# Altium schematic sheet STM32.SchDoc
size Tabloid; SheetNumber: 2; SheetTotal: 4
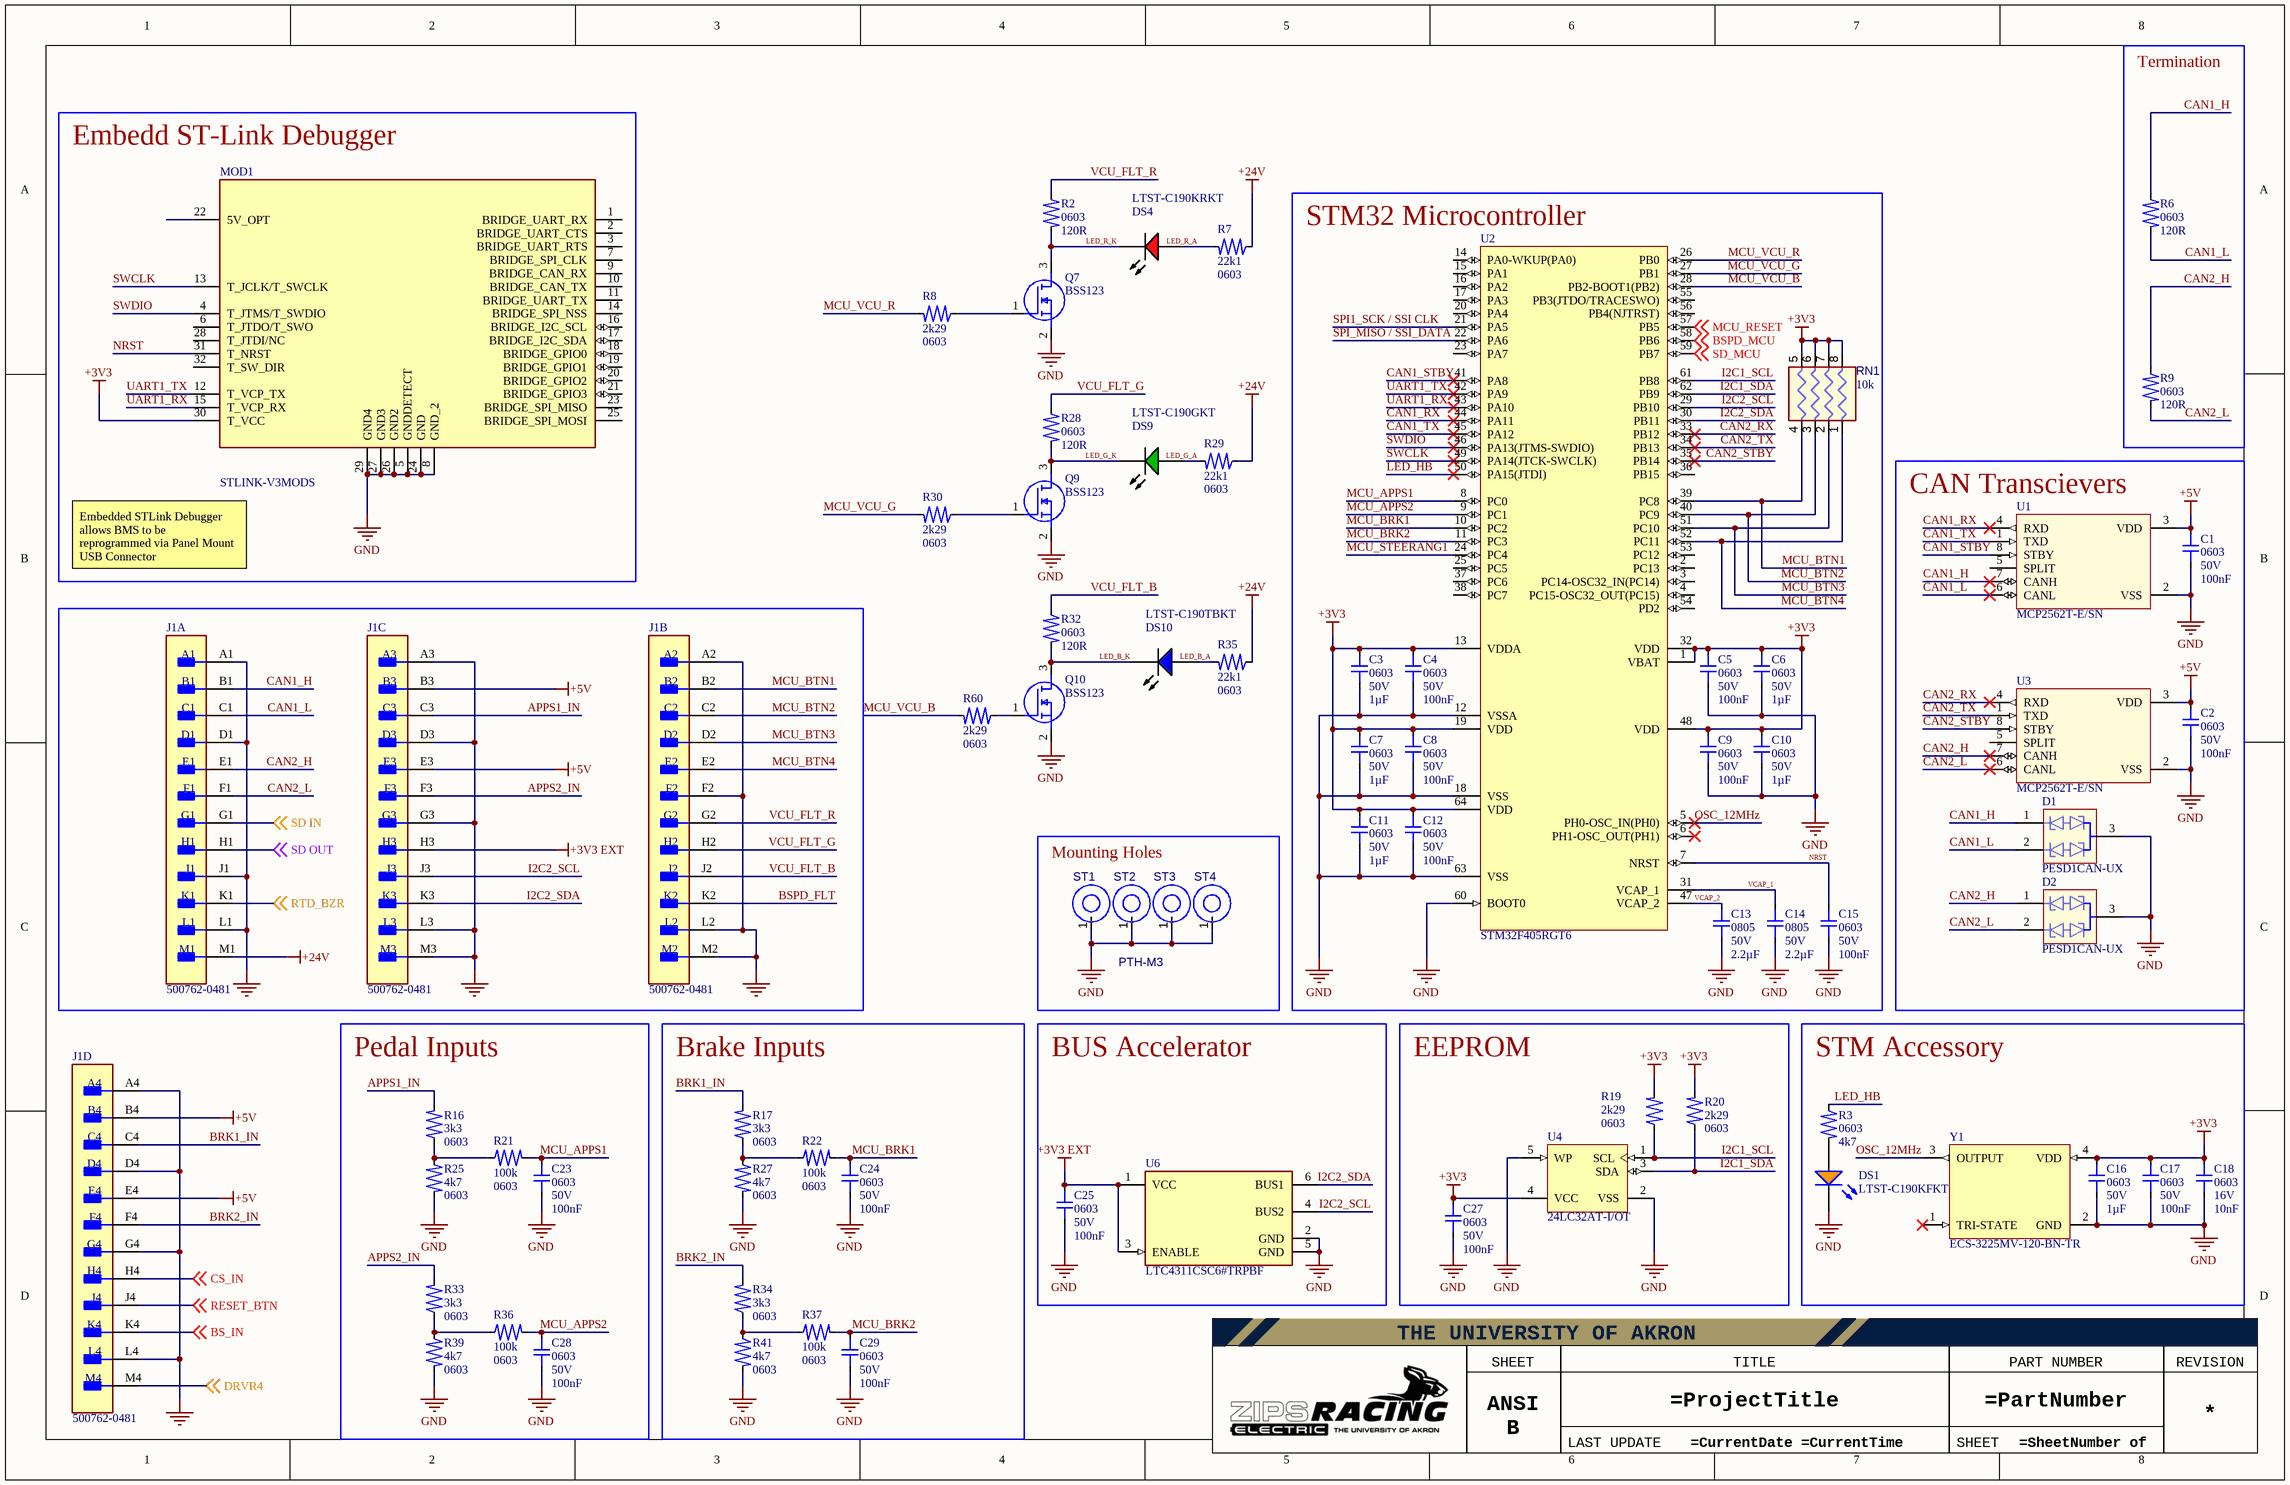
[diagram p0: STM32.SchDoc]

## Parts
C1  value 100nF  Footprint: 0603  Voltage: 50V  [CAP-0603-Generic]  (hidden comment: Capacitor 100nF 0603 5%)
C2  value 100nF  Footprint: 0603  Voltage: 50V  [CAP-0603-Generic]  (hidden comment: Capacitor 100nF 0603 5%)
C3  value 1µF  Footprint: 0603  Voltage: 50V  [CAP-0603-Generic]  (hidden comment: Capacitor 1uF 0603 5%)
C4  value 100nF  Footprint: 0603  Voltage: 50V  [CAP-0603-Generic]  (hidden comment: Capacitor 100nF 0603 5%)
C5  value 100nF  Footprint: 0603  Voltage: 50V  [CAP-0603-Generic]  (hidden comment: Capacitor 100nF 0603 5%)
C6  value 1µF  Footprint: 0603  Voltage: 50V  [CAP-0603-Generic]  (hidden comment: Capacitor 1uF 0603 5%)
C7  value 1µF  Footprint: 0603  Voltage: 50V  [CAP-0603-Generic]  (hidden comment: Capacitor 1uF 0603 5%)
C8  value 100nF  Footprint: 0603  Voltage: 50V  [CAP-0603-Generic]  (hidden comment: Capacitor 100nF 0603 5%)
C9  value 100nF  Footprint: 0603  Voltage: 50V  [CAP-0603-Generic]  (hidden comment: Capacitor 100nF 0603 5%)
C10  value 1µF  Footprint: 0603  Voltage: 50V  [CAP-0603-Generic]  (hidden comment: Capacitor 1uF 0603 5%)
C11  value 1µF  Footprint: 0603  Voltage: 50V  [CAP-0603-Generic]  (hidden comment: Capacitor 1uF 0603 5%)
C12  value 100nF  Footprint: 0603  Voltage: 50V  [CAP-0603-Generic]  (hidden comment: Capacitor 100nF 0603 5%)
C13  value 2.2µF  Footprint: 0805  Voltage: 50V  [CAP-0805]  (hidden comment: Capacitor 2.2F 0805 5%)
C14  value 2.2µF  Footprint: 0805  Voltage: 50V  [CAP-0805]  (hidden comment: Capacitor 2.2F 0805 5%)
C15  value 100nF  Footprint: 0603  Voltage: 50V  [CAP-0603-Generic]  (hidden comment: Capacitor 100nF 0603 5%)
C16  value 1µF  Footprint: 0603  Voltage: 50V  [CAP-0603-Generic]  (hidden comment: Capacitor 1uF 0603 5%)
C17  value 100nF  Footprint: 0603  Voltage: 50V  [CAP-0603-Generic]  (hidden comment: Capacitor 100nF 0603 5%)
C18  value 10nF  Footprint: 0603  Voltage: 16V  [CAP-0603-Generic]  (hidden comment: Capacitor 10nF 0603 5%)
C23  value 100nF  Footprint: 0603  Voltage: 50V  [CAP-0603-Generic]  (hidden comment: Capacitor 100nF 0603 5%)
C24  value 100nF  Footprint: 0603  Voltage: 50V  [CAP-0603-Generic]  (hidden comment: Capacitor 100nF 0603 5%)
C25  value 100nF  Footprint: 0603  Voltage: 50V  [CAP-0603-Generic]  (hidden comment: Capacitor 100nF 0603 5%)
C27  value 100nF  Footprint: 0603  Voltage: 50V  [CAP-0603-Generic]  (hidden comment: Capacitor 100nF 0603 5%)
C28  value 100nF  Footprint: 0603  Voltage: 50V  [CAP-0603-Generic]  (hidden comment: Capacitor 100nF 0603 5%)
C29  value 100nF  Footprint: 0603  Voltage: 50V  [CAP-0603-Generic]  (hidden comment: Capacitor 100nF 0603 5%)
D1  PESD1CAN-UX  [FP-SOT323-MFG]
D2  PESD1CAN-UX  [FP-SOT323-MFG]
DS1  LTST-C190KFKT  [LTST-C190KFKT_V]
DS4  LTST-C190KRKT  [LTST-C191KRKT_V]
DS9  LTST-C190GKT  [LTST-C190GKT_V]
DS10  LTST-C190TBKT  [LTST-C190TBKT-2_V]
J1  500762-0481  [FP-500762-0481-MFG]  (parts A,B,C,D of 4)
MOD1  STLINK-V3MODS  [STLINK-V3MODS-Footprint-1]
Q7  BSS123  [SOT96P237X111-3N]
Q9  BSS123  [SOT96P237X111-3N]
Q10  BSS123  [SOT96P237X111-3N]
R2  value 120R  Footprint: 0603  [RES-0603-Generic]  (hidden comment: Resistor 120R 0603 1%)
R3  value 4k7  Footprint: 0603  [RES-0603-Generic]  (hidden comment: Resistor 4k7 0603 1%)
R6  value 120R  Footprint: 0603  [RES-0603-Generic]  (hidden comment: Resistor 120R 0603 1%)
R7  value 22k1  Footprint: 0603  [RES-0603-Generic]  (hidden comment: Resistor 22k1 0603 1%)
R8  value 2k29  Footprint: 0603  [RES-0603-Generic]  (hidden comment: Resistor 2k49 0603 1%)
R9  value 120R  Footprint: 0603  [RES-0603-Generic]  (hidden comment: Resistor 120R 0603 1%)
R16  value 3k3  Footprint: 0603  [RES-0603-Generic]  (hidden comment: Resistor 3k3 0603 1%)
R17  value 3k3  Footprint: 0603  [RES-0603-Generic]  (hidden comment: Resistor 3k3 0603 1%)
R19  value 2k29  Footprint: 0603  [RES-0603-Generic]  (hidden comment: Resistor 2k49 0603 1%)
R20  value 2k29  Footprint: 0603  [RES-0603-Generic]  (hidden comment: Resistor 2k49 0603 1%)
R21  value 100k  Footprint: 0603  [RES-0603-Generic]  (hidden comment: Resistor 100k 0603 1%)
R22  value 100k  Footprint: 0603  [RES-0603-Generic]  (hidden comment: Resistor 100k 0603 1%)
R25  value 4k7  Footprint: 0603  [RES-0603-Generic]  (hidden comment: Resistor 4k7 0603 1%)
R27  value 4k7  Footprint: 0603  [RES-0603-Generic]  (hidden comment: Resistor 4k7 0603 1%)
R28  value 120R  Footprint: 0603  [RES-0603-Generic]  (hidden comment: Resistor 120R 0603 1%)
R29  value 22k1  Footprint: 0603  [RES-0603-Generic]  (hidden comment: Resistor 22k1 0603 1%)
R30  value 2k29  Footprint: 0603  [RES-0603-Generic]  (hidden comment: Resistor 2k49 0603 1%)
R32  value 120R  Footprint: 0603  [RES-0603-Generic]  (hidden comment: Resistor 120R 0603 1%)
R33  value 3k3  Footprint: 0603  [RES-0603-Generic]  (hidden comment: Resistor 3k3 0603 1%)
R34  value 3k3  Footprint: 0603  [RES-0603-Generic]  (hidden comment: Resistor 3k3 0603 1%)
R35  value 22k1  Footprint: 0603  [RES-0603-Generic]  (hidden comment: Resistor 22k1 0603 1%)
R36  value 100k  Footprint: 0603  [RES-0603-Generic]  (hidden comment: Resistor 100k 0603 1%)
R37  value 100k  Footprint: 0603  [RES-0603-Generic]  (hidden comment: Resistor 100k 0603 1%)
R39  value 4k7  Footprint: 0603  [RES-0603-Generic]  (hidden comment: Resistor 4k7 0603 1%)
R41  value 4k7  Footprint: 0603  [RES-0603-Generic]  (hidden comment: Resistor 4k7 0603 1%)
R60  value 2k29  Footprint: 0603  [RES-0603-Generic]  (hidden comment: Resistor 2k49 0603 1%)
RN1  value 10k  [BOUR-CAY16-J4_V]  (hidden comment: CAY16-103J4LF)
ST1  PTH-M3  [PTH-M2D5X5]  (no BOM)
ST2  PTH-M3  [PTH-M2D5X5]  (value not drawn)  (no BOM)
ST3  PTH-M3  [PTH-M2D5X5]  (value not drawn)  (no BOM)
ST4  PTH-M3  [PTH-M2D5X5]  (value not drawn)  (no BOM)
U1  MCP2562T-E/SN  [MCP2562T-E_SN-Footprint-1]
U2  STM32F405RGT6  [STM-LQFP64_V]
U3  MCP2562T-E/SN  [MCP2562T-E_SN-Footprint-1]
U4  24LC32AT-I/OT  [SOT-23-OT5_L]
U6  LTC4311CSC6#TRPBF  [FP-SC6-6-05-08-1638-IPC_A]
Y1  ECS-3225MV-120-BN-TR  [ECS-3225MV-120-BN-TR-Footprint-1]

## Blocks framed on the sheet
Termination: R6 R9
Embedd ST-Link Debugger: MOD1
STM32 Microcontroller: C3-C15 RN1 U2
CAN Transcievers: C1 C2 D1 D2 U1 U3
Mounting Holes: ST1-ST4
Pedal Inputs: C23 C28 R16 R21 R25 R33 R36 R39
Brake Inputs: C24 C29 R17 R22 R27 R34 R37 R41
BUS Accelerator: C25 U6
EEPROM: C27 R19 R20 U4
STM Accessory: C16-C18 DS1 R3 Y1

## Nets
+3V3: C3.2 C4.2 C5.2 C6.2 C7.2 C8.2 C9.2 C10.2 C11.2 C12.2 C16.2 C17.2 C18.2 C27.2 MOD1.30(T_VCC) R19.2 R20.2 RN1.5 RN1.6 RN1.7 RN1.8 U2.1(VBAT) U2.13(VDDA) U2.19(VDD) U2.32(VDD) U2.48(VDD) U2.64(VDD) U4.4(VCC) Y1.4(VDD)
+3V3 EXT: C25.2 J1.H3 U6.1(VCC) U6.3(ENABLE)
+5V: C1.2 C2.2 J1.B3 J1.B4 J1.E3 J1.E4 U1.3(VDD) U3.3(VDD)
+24V: J1.M1 R7.1 R29.1 R35.1
GND: C1.1 C2.1 C3.1 C4.1 C5.1 C6.1 C7.1 C8.1 C9.1 C10.1 C11.1 C12.1 C13.1 C14.1 C15.1 C16.1 C17.1 C18.1 C23.1 C24.1 C25.1 C27.1 C28.1 C29.1 D1.3(common_cathode) D2.3(common_cathode) DS1.2(K) J1.A1 J1.A2 J1.A3 J1.A4 J1.D1 J1.D3 J1.D4 J1.F2 J1.G3 J1.G4 J1.J1 J1.L1 J1.L2 J1.L3 J1.L4 J1.M2 J1.M3 MOD1.5(GNDDETECT) MOD1.8(GND_2) MOD1.24(GND) MOD1.26(GND2) MOD1.27(GND3) MOD1.29(GND4) Q7.2(S) Q9.2(S) Q10.2(S) R25.2 R27.2 R39.2 R41.2 ST1.1(H1) ST2.1(H1) ST3.1(H1) ST4.1(H1) U1.2(VSS) U2.12(VSSA) U2.18(VSS) U2.60(BOOT0) U2.63(VSS) U3.2(VSS) U4.2(VSS) U4.5(WP) U6.2(GND) U6.5(GND) Y1.2(GND)
APPS1_IN: J1.C3 R16.2
APPS2_IN: J1.F3 R33.2
BRK1_IN: J1.C4 R17.2
BRK2_IN: J1.F4 R34.2
BS_IN: J1.K4 ; off-sheet BS_IN
BSPD_FLT: J1.K2
BSPD_MCU: U2.58(PB6) ; off-sheet BSPD_MCU
CAN1_H: D1.1(cathode_1) J1.B1 R6.1 U1.7(CANH)
CAN1_L: D1.2(cathode_2) J1.C1 R6.2 U1.6(CANL)
CAN1_RX: U1.4(RXD) U2.44(PA11)
CAN1_STBY: U1.8(STBY) U2.41(PA8)
CAN1_TX: U1.1(TXD) U2.45(PA12)
CAN2_H: D2.1(cathode_1) J1.E1 R9.1 U3.7(CANH)
CAN2_L: D2.2(cathode_2) J1.F1 R9.2 U3.6(CANL)
CAN2_RX: U2.33(PB12) U3.4(RXD)
CAN2_STBY: U2.35(PB14) U3.8(STBY)
CAN2_TX: U2.34(PB13) U3.1(TXD)
CS_IN: J1.H4 ; off-sheet CS_IN
DRVR4: J1.M4 ; off-sheet DRVR4
I2C1_SCL: R19.1 U2.61(PB8) U4.1(SCL)
I2C1_SDA: R20.1 U2.62(PB9) U4.3(SDA)
I2C2_SCL: J1.J3 U2.29(PB10) U6.4(BUS2)
I2C2_SDA: J1.K3 U2.30(PB11) U6.6(BUS1)
LED_B_A: DS10.1(A) R35.2
LED_B_K: DS10.2(K) Q10.3(D) R32.2
LED_G_A: DS9.1(A) R29.2
LED_G_K: DS9.2(K) Q9.3(D) R28.2
LED_HB: R3.1 U2.50(PA15(JTDI))
LED_R_A: DS4.1(A) R7.2
LED_R_K: DS4.2(K) Q7.3(D) R2.2
MCU_APPS1: C23.2 R21.2 U2.8(PC0)
MCU_APPS2: C28.2 R36.2 U2.9(PC1)
MCU_BRK1: C24.2 R22.2 U2.10(PC2)
MCU_BRK2: C29.2 R37.2 U2.11(PC3)
MCU_BTN1: J1.B2 RN1.4 U2.39(PC8)
MCU_BTN2: J1.C2 RN1.3 U2.40(PC9)
MCU_BTN3: J1.D2 RN1.2 U2.51(PC10)
MCU_BTN4: J1.E2 RN1.1 U2.52(PC11)
MCU_RESET: U2.57(PB5) ; off-sheet MCU_RESET
MCU_STEERANG1: U2.24(PC4)
MCU_VCU_B: R60.2 U2.28(PB2-BOOT1(PB2))
MCU_VCU_G: R30.2 U2.27(PB1)
MCU_VCU_R: R8.2 U2.26(PB0)
NRST: C15.2 MOD1.31(T_NRST) U2.7(NRST)
OSC_12MHz: U2.5(PH0-OSC_IN(PH0)) Y1.3(OUTPUT)
RESET_BTN: J1.J4 ; off-sheet RESET_BTN
RTD_BZR: J1.K1 ; off-sheet RTD_BZR
SD IN: J1.G1 ; off-sheet SD IN
SD OUT: J1.H1 ; off-sheet SD OUT
SD_MCU: U2.59(PB7) ; off-sheet SD_MCU
SPI1_SCK / SSI CLK: U2.21(PA5)
SPI_MISO / SSI_DATA: U2.22(PA6)
SWCLK: MOD1.13(T_JCLK/T_SWCLK) U2.49(PA14(JTCK-SWCLK))
SWDIO: MOD1.4(T_JTMS/T_SWDIO) U2.46(PA13(JTMS-SWDIO))
UART1_RX: MOD1.15(T_VCP_RX) U2.43(PA10)
UART1_TX: MOD1.12(T_VCP_TX) U2.42(PA9)
VCAP_1: C14.2 U2.31(VCAP_1)
VCAP_2: C13.2 U2.47(VCAP_2)
VCU_FLT_B: J1.J2 R32.1
VCU_FLT_G: J1.H2 R28.1
VCU_FLT_R: J1.G2 R2.1
NetDS1_1: DS1.1(A) R3.2
NetQ7_1: Q7.1(G) R8.1
NetQ9_1: Q9.1(G) R30.1
NetQ10_1: Q10.1(G) R60.1
NetR16_1: R16.1 R21.1 R25.1
NetR17_1: R17.1 R22.1 R27.1
NetR33_1: R33.1 R36.1 R39.1
NetR34_1: R34.1 R37.1 R41.1

Not connected (* = marked no-connect by the designer): MOD1 1(BRIDGE_UART_RX) 2(BRIDGE_UART_CTS) 3(BRIDGE_UART_RTS) 6(T_JTDO/T_SWO) 7(BRIDGE_SPI_CLK) 9(BRIDGE_CAN_RX) 10(BRIDGE_CAN_TX) 11(BRIDGE_UART_TX) 14(BRIDGE_SPI_NSS) 16(BRIDGE_I2C_SCL) 17(BRIDGE_I2C_SDA) 18(BRIDGE_GPIO0) 19(BRIDGE_GPIO1) 20(BRIDGE_GPIO2) 21(BRIDGE_GPIO3) 22(5V_OPT) 23(BRIDGE_SPI_MISO) 25(BRIDGE_SPI_MOSI) 28(T_JTDI/NC) 32(T_SW_DIR); U1 5(SPLIT); U2 2(PC13) 3(PC14-OSC32_IN(PC14)) 4(PC15-OSC32_OUT(PC15)) 6(PH1-OSC_OUT(PH1))* 14(PA0-WKUP(PA0)) 15(PA1) 16(PA2) 17(PA3) 20(PA4) 23(PA7) 25(PC5) 36(PB15) 37(PC6) 38(PC7) 53(PC12) 54(PD2) 55(PB3(JTDO/TRACESWO)) 56(PB4(NJTRST)); U3 5(SPLIT); Y1 1(TRI-STATE)*

## Notes on the sheet
- Embedded STLink Debugger allows BMS to be reprogrammed via Panel Mount USB Connector
- THE UNIVERSITY OF AKRON
- SHEET SIZE
- TITLE
- PART NUMBER
- REVISION
- ANSI B
- LAST UPDATE
- SHEET

## Library data of the parts
C1 C2 C4 C5 C8 C9 C12 C15 C17 C23-C25 C27-C29 = CMP-00030-2: Capacitor, 0603, 5%; Max Operating Temperature: 125°C; Min Operating Temperature: -55°C
C3 C6 C7 C10 C11 C16 = CMP-00043-1: Capacitor, 0603, 5%; Min Operating Temperature: -55°C; Max Operating Temperature: 85°C
C13 C14 = CMP-00042-1: Capacitor, 0805, 5%
C18 = CMP-00044-1: Capacitor, 0603, 5%; Min Operating Temperature: -55°C; Max Operating Temperature: 125°C
D1 D2 = CMP-004-00033-2: Trans Voltage Suppressor Diode, 150W, 24V V(RWM), Bidirectional, 2 Element, Silicon
DS1 = CMP-007-00023-2: LED Uni-Color Orange, 75 mW, 30 mA, -35 to 85 degC, 2-Pin SMD, RoHS, Tape and Reel; Manufacturer: Lite-On; Power: 75mW; Luminous Intensity: 90mcd; Nominal Vf: 2V; Lens Style: Diffused; Forward Current: 20mA; Viewing Angle: 130degrees; Max Operating Temperature: 85°C; Manufacturer URL: http://www.us.liteon.com/; Package Description: 2-Pin Surface Mount Device, Body 1.6 x 0.8 mm; Package Quantity: 3000; Pins: 2; Min Operating Temperature: -55°C; Mounting Technology: SM; Colour: Orange; Packaging: TapeandReel; Case/Package: 0603; Datasheet Version: Rev. I, 09/2011; Illumination Colour: Orange; Datasheet URL: http://optoelectronics.liteon.com/upload/download/DS-22-99-0186/S_110_LTST-C190KFKT.pdf; Package Reference: C190KFKT; RoHS Compliant: True; Forward Voltage: 2V
DS4 = CMP-007-00024-2: LED Uni-Color Red, 62.5 mW, 25 mA, -30 to 85 degC, 2-Pin SMD, RoHS, Tape and Reel; Manufacturer: Lite-On; Power: 75mW; Forward Voltage: 2V; Luminous Intensity: 54mcd; Lens Style: Diffused; Viewing Angle: 130degrees; Forward Current: 20mA; Manufacturer URL: http://www.us.liteon.com/; Case/Package: 0603; Datasheet Version: Rev. F, 05/2013; Package Reference: C191KRKT; Datasheet URL: http://optoelectronics.liteon.com/upload/download/DS-22-99-0151/S_110_LTST-C190KRKT.pdf; Package Description: 2-Pin Surface Mount Device, Body 1.6 x 0.8 mm; Nominal Vf: 2V; Packaging: TapeandReel; RoHS Compliant: True; Pins: 2; Illumination Colour: Red; Colour: Red; Mounting Technology: SM; Package Quantity: 3000; Min Operating Temperature: -55°C; Max Operating Temperature: 85°C
DS9 = CMP-007-00022-2: LED Uni-Color Green, 100 mW, 30 mA, -55 to 85 degC, 2-Pin SMD, RoHS, Tape and Reel; Manufacturer: Lite-On; Power: 100mW; Forward Voltage: 2.1V; Viewing Angle: 130degrees; Forward Current: 20mA; Luminous Intensity: 6mcd; Lens Style: Clear; Manufacturer URL: http://www.us.liteon.com/; RoHS Compliant: True; Colour: Green; Package Description: 2-Pin Surface Mount Device, Body 1.6 x 0.8 mm; Datasheet URL: http://datasheet.octopart.com/LTST-C190GKT-Lite-On-datasheet-158530.pdf; Datasheet Version: Dec-06; Mounting Technology: SM; Case/Package: 0603; Package Reference: C190GKT; Packaging: TapeandReel; Min Operating Temperature: -55°C; Nominal Vf: 2.1V; Package Quantity: 3000; Illumination Colour: Green; Max Operating Temperature: 85°C; Pins: 2
DS10 = CMP-007-00026-2: LED Uni-Color Blue, 76 mW, 20 mA, -20 to 80 degC, 2-Pin SMD, RoHS, Tape and Reel; Manufacturer: Lite-On; Forward Voltage: 2.8V; Lens Style: Diffused; Luminous Intensity: 28mcd; Forward Current: 20mA; Viewing Angle: 130degrees; Nominal Vf: 3.3V; Packaging: TapeandReel; Min Operating Temperature: -20°C; Illumination Colour: Blue; Package Quantity: 3000; Pins: 2; Mounting Technology: SM; Package Reference: C190TBKT-2; Package Description: 2-Pin Surface Mount Device, Body 1.6 x 0.8 mm; RoHS Compliant: True; Datasheet URL: http://optoelectronics.liteon.com/upload/download/DS-22-99-0224/S_110_LTST-C190TBKT(0630).pdf; Datasheet Version: Rev. K, 08/2011; Manufacturer URL: http://www.us.liteon.com/; Colour: Blue; Case/Package: 0603; Max Operating Temperature: 80°C
J1 = CMP-002-00162-1: Board Connector, 48 Contact(s), 4 Row(s), Male, Right Angle, 0.098 inch Pitch, Solder Terminal, Black Insulator; Connector Type: COMBINATION LINE CONNECTOR; Mounting Technology: Board; RoHS Compliant: Yes
MOD1 = CMP-00046-2: STLINK V3 Debugger Board Module
Q7 Q9 Q10 = CMP-023-000002-1: MOSFET N-CH 100V 170MA SOT23-3; Manufacturer_Name: ON Semiconductor; Datasheet Link: http://uk.rs-online.com/web/p/products/6710321; Mouser Price/Stock: https://www.mouser.co.uk/ProductDetail/ON-Semiconductor-Fairchild/BSS123?qs=FOlmdCx%252BAA2Kf8SEB3qLYA%3D%3D; Arrow Part Number: BSS123; Arrow Price/Stock: https://www.arrow.com/en/products/bss123/on-semiconductor; Manufacturer_Part_Number: BSS123; Source: Zips_Racing_Electric.SchLib; Design Item ID: BSS123; Height: 1.11mm; Mouser Part Number: 512-BSS123
R2 R6 R9 R28 R32 = CMP-00031-1: Resistor, 0603, 1%, 1/10W; Power: 100mW; Datasheet: https://www.seielect.com/catalog/sei-rmcf_rmcp.pdf; Max Operating Temperature: 155°C; Tolerance: 1%; Min Operating Temperature: -55°C
R3 R25 R27 R39 R41 = CMP-00023-3: Resistor, 0603, 1%, 1/10W; Power: 100mW; Tolerance: 1%; Datasheet: https://www.seielect.com/catalog/sei-rmcf_rmcp.pdf; Max Operating Temperature: 155°C; Min Operating Temperature: -55°C
R7 R29 R35 = CMP-00029-1: Resistor, 0603, 1%, 1/10W; Power: 100mW; Tolerance: 1%; Datasheet: https://www.seielect.com/catalog/sei-rmcf_rmcp.pdf; Max Operating Temperature: 155°C; Min Operating Temperature: -55°C
R8 R19 R20 R30 R60 = CMP-00028-1: Resistor, 0603, 1%, 1/10W; Power: 100mW; Max Operating Temperature: 155°C; Min Operating Temperature: -55°C; Tolerance: 1%; Datasheet: https://www.seielect.com/catalog/sei-rmcf_rmcp.pdf
R16 R17 R33 R34 = CMP-00056-1: Resistor, 0603, 1%, 1/10W; Power: 100mW; Tolerance: 1%; Min Operating Temperature: -55°C; Max Operating Temperature: 155°C; Datasheet: https://www.seielect.com/catalog/sei-rmcf_rmcp.pdf
R21 R22 R36 R37 = CMP-00052-1: Resistor, 0603, 1%, 1/10W; Power: 100mW; Min Operating Temperature: -55°C; Tolerance: 1%; Max Operating Temperature: 155°C; Datasheet: https://www.seielect.com/catalog/sei-rmcf_rmcp.pdf
RN1 = CMP-009-00043-4: Chip Resistor Array, 10 KOhm, +/- 5%, 62.5 mW, -55 to 125 degC, 8-Pin SMD, RoHS, Tape and Reel; Manufacturer: Bourns; Elements: 4; Power: 248mW; Voltage Rating: 50V; Min Operating Temperature: -55°C; Package Description: 8-Pin Surface Mount Device, Body 1.6 x 3.2 mm, Pitch 0.8 mm; Pins: 8; Max Operating Temperature: 125°C; Packaging: CutTape; RoHS Compliant: True; Tolerance: 5%; Case/Package: 1205; Datasheet URL: http://www.bourns.com/docs/Product-Datasheets/CATCAY.pdf; Manufacturer URL: http://www.bourns.com/; Package Reference: CAY16-J4; Mounting Technology: SM; Datasheet Version: Jan-15; Package Quantity: 1
ST1-ST4 = CMP-00028-00008-6: M3 Plated Thru-Hole  (3.2mm), 7mm pad, 10 mm keep out zone; Pins: 1
U1 U3 = CMP-000001-7: IC TXRX CAN 8SOIC; Receiver Hysteresis: 200mV; Propagation Delay: 125ns; Min Supply Voltage: 1.8V; Operating Supply Current: 70mA; Max Supply Voltage: 5.5V; Simplex/Duplex: Half Duplex; Data Rate: 1Mbps; Packaging: Cut Tape; Mounting Technology: Surface Mount; Lead Free: Lead Free; Case/Package: SOIC; Package Quantity: 3300; Min Operating Temperature: -40°C; Max Operating Temperature: 125°C; Type: Integrated Circuit (IC); Pins: 8
U2 = CMP-020-00030-5: RISC Microcontroller, 32-Bit, FLASH, CORTEX-M4 CPU, 168MHz, CMOS, PQFP64; Max Supply Voltage: 3.6V; Clock Frequency: 50MHz; Min Supply Voltage: 1.8V; Nominal Supply Voltage: 3.3V; Pins: 64; RoHS Compliant: Yes; Case/Package: LFQFP; Min Operating Temperature: -40°C; Max Operating Temperature: 85°C
U4 = CMP-019-00068-2: EEPROM, 4KX8, Serial, CMOS, PDSO5; Memory Size: 4096; Clock Frequency: 400kHz; Min Supply Voltage: 2.5V; Max Supply Voltage: 5.5V; Max Operating Temperature: 85°C; Memory Format: EEPROM; Case/Package: LSSOP; RoHS Compliant: Yes; Min Operating Temperature: -40°C; Pins: 5
U6 = CMP-031-00034-1: Analog Circuit, 1 Func, PDSO6; Min Supply Voltage: 1.6V; Max Supply Voltage: 5.5V; Min Operating Temperature: 0°C; Pins: 6; Max Operating Temperature: 70°C; RoHS Compliant: Yes; Case/Package: VSSOP
Y1 = CMP-003-00034-2: HCMOS Output Clock Oscillator, 12MHz Nom; Frequency: 12MHz